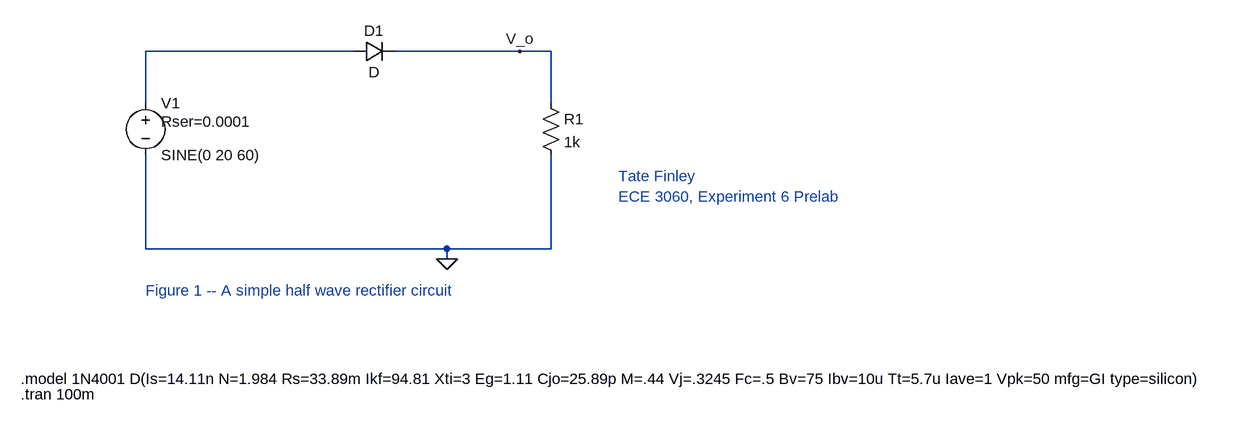
[diagram p0: schematic ECE3060_Lab6nocap.asc]
ECE3060_Lab6nocap.asc, the LTspice schematic file:
Version 4
SHEET 1 1944 680
WIRE 416 -240 96 -240
WIRE 672 -240 480 -240
WIRE 720 -240 672 -240
WIRE 96 -160 96 -240
WIRE 720 -160 720 -240
WIRE 96 64 96 -80
WIRE 560 64 96 64
WIRE 720 64 720 -80
WIRE 720 64 560 64
WIRE 560 80 560 64
FLAG 560 80 0
FLAG 672 -240 V_o
SYMBOL voltage 96 -176 R0
WINDOW 123 0 0 Left 0
WINDOW 39 24 44 Left 2
SYMATTR SpiceLine Rser=0.0001
SYMATTR InstName V1
SYMATTR Value SINE(0 20 60)
SYMBOL diode 416 -224 R270
WINDOW 0 32 32 VTop 2
WINDOW 3 0 32 VBottom 2
SYMATTR InstName D1
SYMBOL res 704 -176 R0
SYMATTR InstName R1
SYMATTR Value 1k
TEXT -96 264 Left 2 !.model 1N4001 D(Is=14.11n N=1.984 Rs=33.89m Ikf=94.81 Xti=3 Eg=1.11 Cjo=25.89p M=.44 Vj=.3245 Fc=.5 Bv=75 Ibv=10u Tt=5.7u Iave=1 Vpk=50 mfg=GI type=silicon)
TEXT -96 288 Left 2 !.tran 100m
TEXT 96 128 Left 2 ;Figure 1 -- A simple half wave rectifier circuit
TEXT 824 -48 Left 2 ;Tate Finley\nECE 3060, Experiment 6 Prelab

The netlist it stands for:
* ECE3060_Lab6nocap.asc
V1 N001 0 SINE(0 20 60) Rser=0.0001
D1 N001 V_o D
R1 V_o 0 1k
.model D D
.lib standard.dio
.model 1N4001 D(Is=14.11n N=1.984 Rs=33.89m Ikf=94.81 Xti=3 Eg=1.11 Cjo=25.89p M=.44 Vj=.3245 Fc=.5 Bv=75 Ibv=10u Tt=5.7u Iave=1 Vpk=50 mfg=GI type=silicon)
.tran 100m
* Figure 1 -- A simple half wave rectifier circuit
* Tate Finley
* ECE 3060, Experiment 6 Prelab
.backanno
.end